# EAGLE design espnative-deadrail-2-7-rendered (EAGLE 7.6.0)
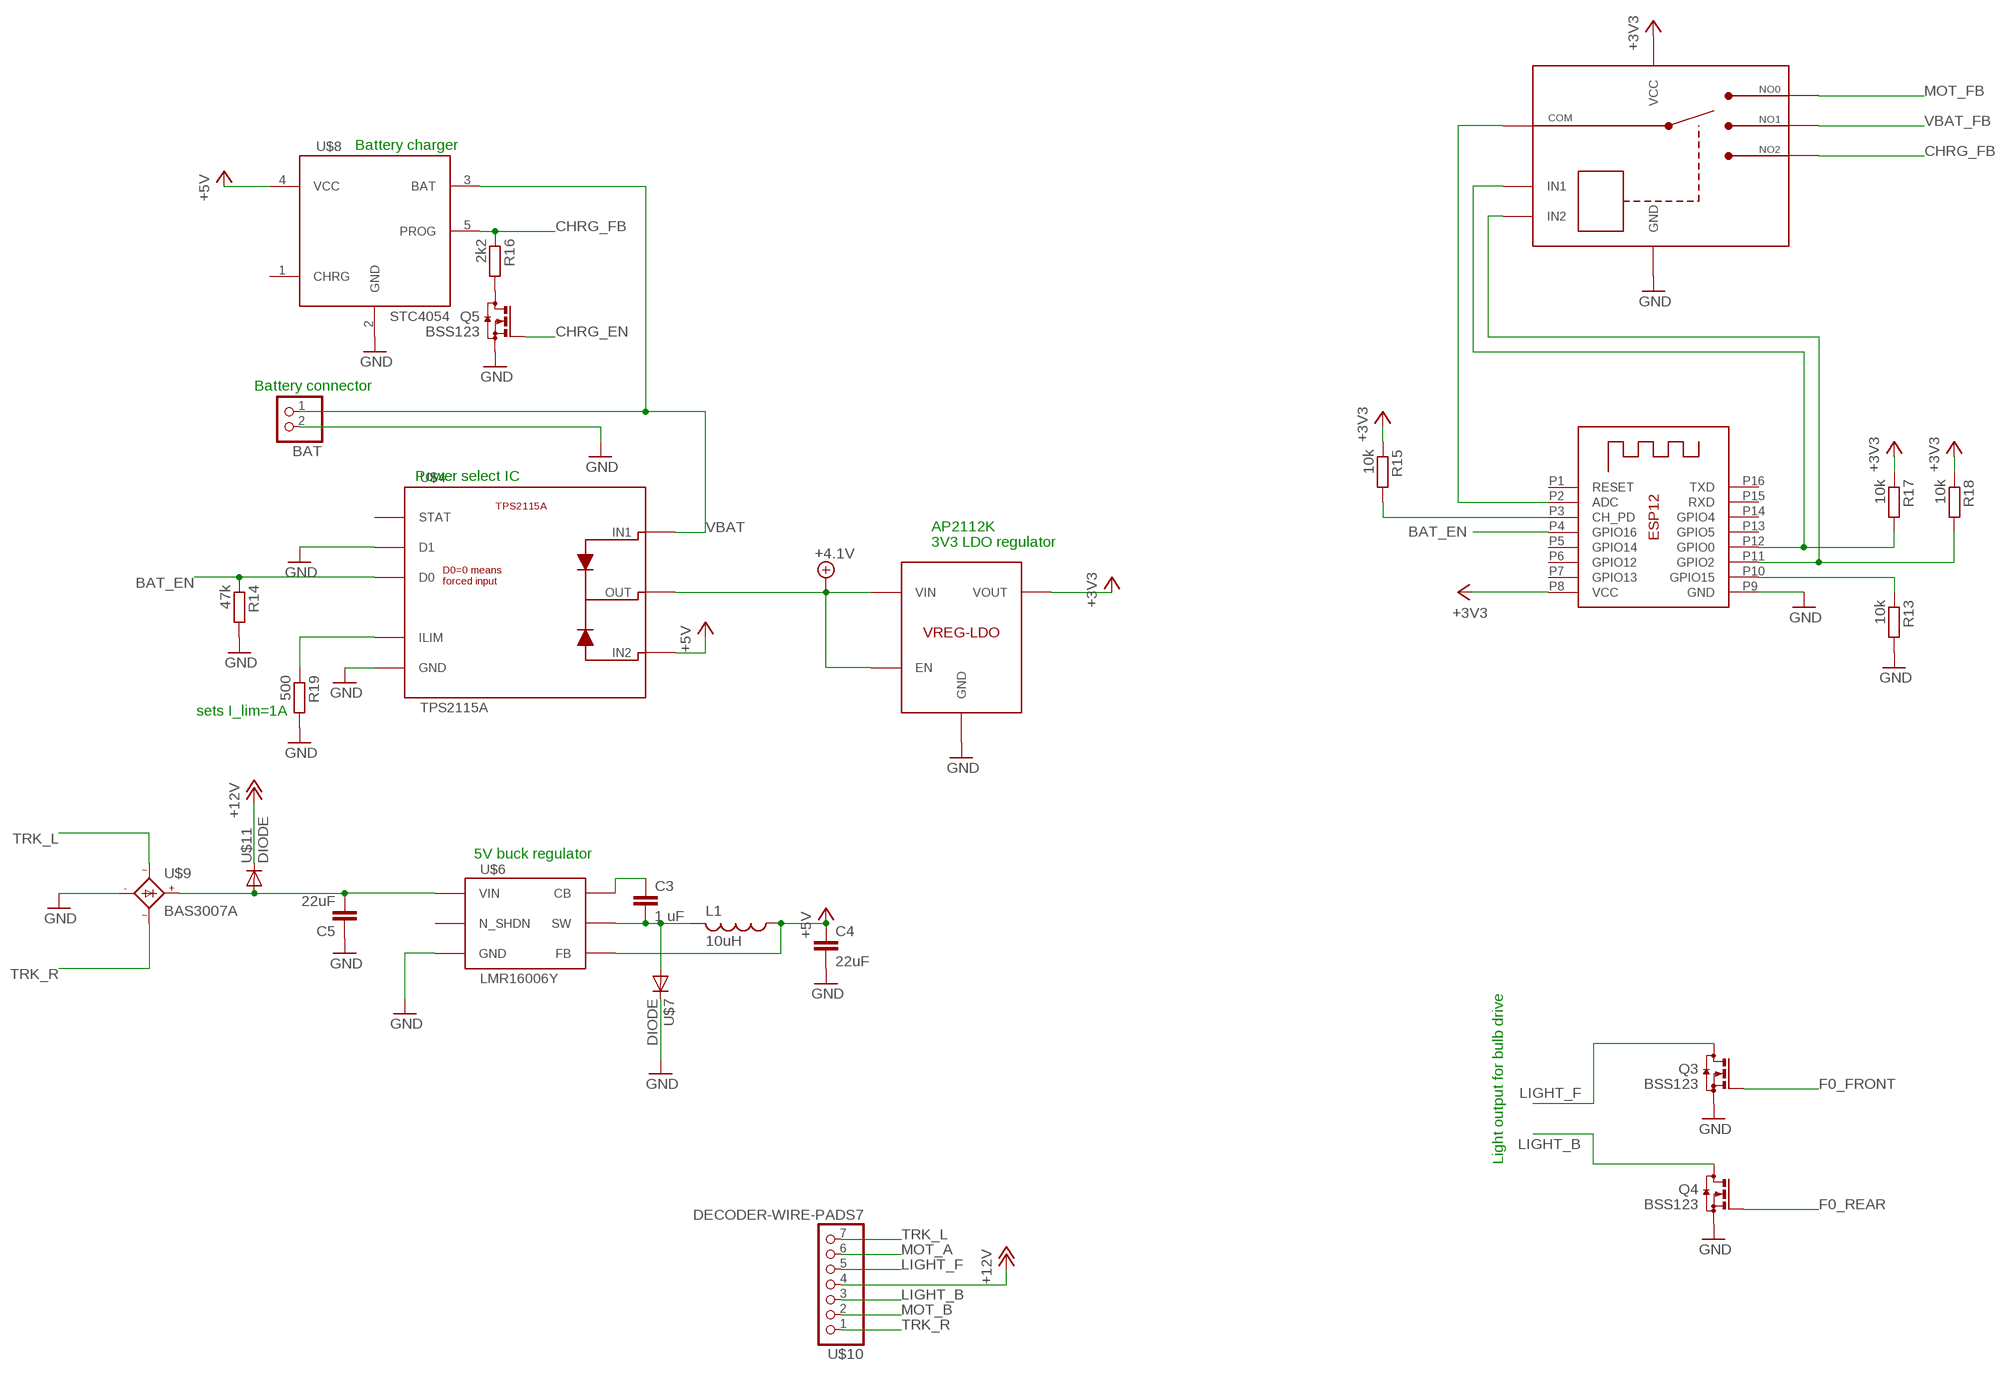
[diagram p0: schematic, sheet 1, part 1 of 2]
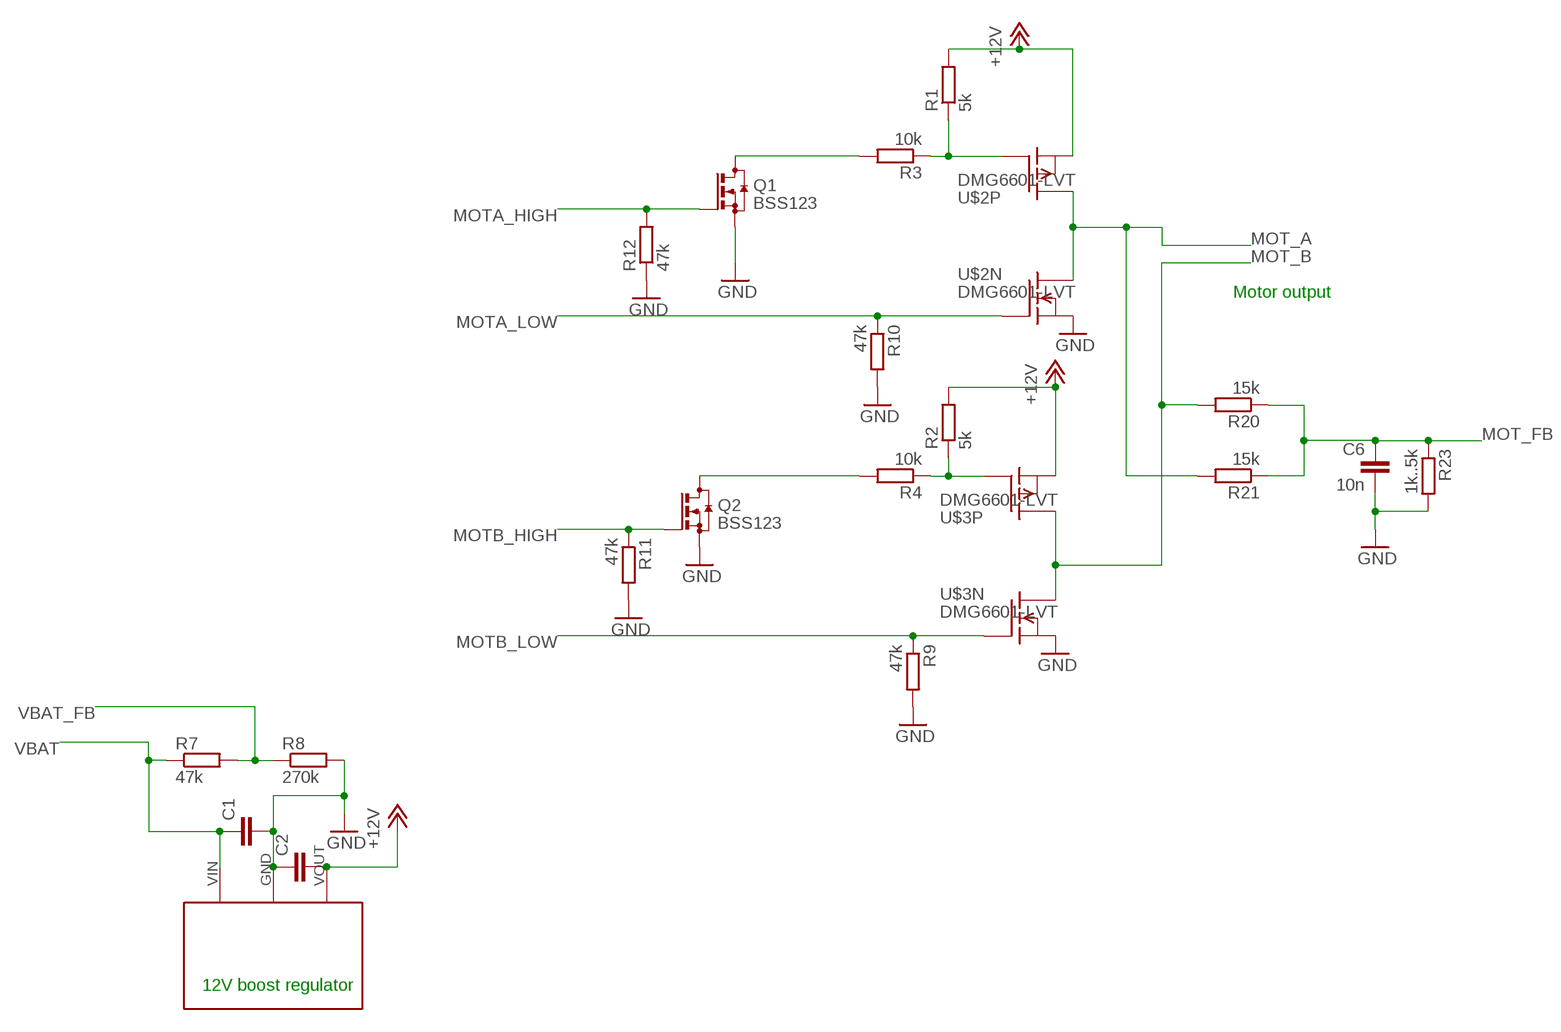
[diagram p1: schematic, sheet 1, part 2 of 2]

## Parts
BAT  JST_2PIN-SMT-RA  [JST-PH-2-SMT-RA]
C1  C-EUC1206  [C1206]
C2  C-EUC1206  [C1206]
C3  1 uF  C-EUC0603  [C0603]
C4  22uF  C-EUC0603  [C0603]
C5  22uF  C-EUC1206  [C1206]
C6  10n  C-EUC0603  [C0603]
L1  10uH  FDSD0420  [FDSD0420]
Q1  BSS123  [SOT23]
Q2  BSS123  [SOT23]
Q3  BSS123  [SOT23]
Q4  BSS123  [SOT23]
Q5  BSS123  [SOT23]
R1  5k  R-EU_R0603  [R0603]
R2  5k  R-EU_R0603  [R0603]
R3  10k  R-EU_R0603  [R0603]
R4  10k  R-EU_R0603  [R0603]
R7  47k  R-EU_R0603  [R0603]
R8  270k  R-EU_R0603  [R0603]
R9  47k  R-EU_R0603  [R0603]
R10  47k  R-EU_R0603  [R0603]
R11  47k  R-EU_R0603  [R0603]
R12  47k  R-EU_R0603  [R0603]
R13  10k  R-EU_R0603  [R0603]
R14  47k  R-EU_R0603  [R0603]
R15  10k  R-EU_R0603  [R0603]
R16  2k2  R-EU_R0603  [R0603]
R17  10k  R-EU_R0603  [R0603]
R18  10k  R-EU_R0603  [R0603]
R19  500  R-EU_R0603  [R0603]
R20  15k  R-EU_R0603  [R0603]
R21  15k  R-EU_R0603  [R0603]
R23  1k..5k  R-EU_R0603  [R0603]
U$1  AP2112K-3V3  AP2112K  [SOT23-5L]
U$2  DMG6601-LVT  [TSOT-26]
U$3  DMG6601-LVT  [TSOT-26]
U$4  TPS2115A  [TSSOP-8]
U$5  POLOLU-VREG12  [POLOLU-REGULATOR]
U$6  LMR16006Y  [SOT23-6]
U$7  DIODE  [DIODE-1206]
U$8  STC4054  [SOT23-5L]
U$9  BAS3007A  [SOT143B]
U$10  DECODER-WIRE-PADS7  [DECODER-WIRE-PADS]
U$11  DIODE  [DIODE-1206]
U$12  TS5A3359  [US8]
X1  ESP-12-TH  [ESP-12-TH]

## Nets
+3V3: R15.1 R17.1 R18.1 U$1.5(VOUT) U$12.8(VCC) X1.P8(VCC)
+4.1V: U$1.1(VIN) U$1.3(EN) U$4.7(OUT)
+5V: C4.1 L1.P$1 U$4.6(IN2) U$6.3(FB) U$8.4(VCC)
+12V: C2.2 R1.2 R2.2 U$2.2(P:S) U$3.2(P:S) U$5.VOUT U$10.4 U$11.C
BAT_EN: R14.1 U$4.2(D0) X1.P4(GPIO16)
CHRG_EN: Q5.1(G)
CHRG_FB: R16.1 U$8.5(PROG) U$12.3(NO2)
DCC_VPLUS: C5.2 U$6.5(VIN) U$9.4(+) U$11.A
F0_FRONT: Q3.1(G)
F0_REAR: Q4.1(G)
GND: BAT.2 C1.2 C2.1 C4.2 C5.1 C6.2 Q1.2(S) Q2.2(S) Q3.2(S) Q4.2(S) Q5.2(S) R8.2 R9.2 R10.2 R11.2 R12.1 R13.2 R14.2 R19.2 R23.2 U$1.2(GND) U$2.5(N:S) U$3.5(N:S) U$4.3(D1) U$4.5(GND) U$5.GND U$6.2(GND) U$7.C U$8.2(GND) U$9.1(-) U$12.4(GND) X1.P9(GND)
LIGHT_B: Q4.3(D) U$10.3
LIGHT_F: Q3.3(D) U$10.5
MOT_A: R21.2 U$2.4(P:D) U$2.6(N:D) U$10.6
MOT_B: R20.2 U$3.4(P:D) U$3.6(N:D) U$10.2
MOT_FB: C6.1 R20.1 R21.1 R23.1 U$12.1(NO0)
MOTA_HIGH: Q1.1(G) R12.2
MOTA_LOW: R10.1 U$2.1(N:G)
MOTB_HIGH: Q2.1(G) R11.1
MOTB_LOW: R9.1 U$3.1(N:G)
N$1: U$12.7(COM) X1.P2(ADC)
N$2: R1.1 R3.1 U$2.3(P:G)
N$3: Q2.3(D) R4.2
N$4: R2.1 R4.1 U$3.3(P:G)
N$5: C3.2 L1.P$2 U$6.6(SW) U$7.A
N$6: Q1.3(D) R3.2
N$8: C3.1 U$6.1(CB)
N$11: Q5.3(D) R16.2
N$12: R17.2 U$12.6(IN1) X1.P12(GPIO0)
N$17: R15.2 X1.P3(CH_PD)
N$20: R18.2 U$12.5(IN2) X1.P11(GPIO2)
N$21: R13.1 X1.P10(GPIO15)
N$22: R19.1 U$4.4(ILIM)
TRK_L: U$9.2(AC1) U$10.7
TRK_R: U$9.3(AC2) U$10.1
VBAT: BAT.1 C1.1 R7.1 U$4.8(IN1) U$5.VIN U$8.3(BAT)
VBAT_FB: R7.2 R8.1 U$12.2(NO1)
Unconnected: U$4.1(STAT) U$6.4(N_SHDN) U$8.1(CHRG) X1.P1(RESET) X1.P5(GPIO14) X1.P6(GPIO12) X1.P7(GPIO13) X1.P13(GPIO5) X1.P14(GPIO4) X1.P15(RXD) X1.P16(TXD)

## Notes on the sheet
- Battery charger
- Battery connector
- Power select IC
- AP2112K
  3V3 LDO regulator
- Motor output
- sets I_lim=1A
- 5V buck regulator
- Light output for bulb drive
- 12V boost regulator

## Library data of the parts
BAT = adafruit:JST_2PIN: JST 2-Pin Connectors of various flavors SMT-RA (S2B-PH-SM4) 4UConnector #17311 SMT (B2B-PH-SM4) THM-RA (S2B-PH) THM (B2B-PH)
C1-C6 = rcl:C-EU: CAPACITOR, European symbol
L1 = trainlib:FDSD0420
Q1-Q5 = transistor-small-signal:BSS123: N-CHANNEL MOS FET
R1-R4 R7-R21 R23 = rcl:R-EU_: RESISTOR, European symbol
U$1 = trainlib:AP2112: 600mA CMOS LDO regulator with enable http://www.diodes.com/_files/datasheets/AP2112.pdf http://www.digikey.com/product-detail/en/diodes-incorporated/AP2112K-3.3TRG1/AP2112K-3.3TRG1DICT-ND/4505257 Package includes sot23-5.
U$2 U$3 = trainlib:DMG6601-LVT: Dual N+P-channel MOSFET. Package: TSOT-26 Vmax=30V N-channel: 55mOhm, 3.8A Imax P-channel: 110mOhm, 2.5A Imax
U$4 = trainlib:TPS2115A: Power source select Ideal diode pair selects power source from two alternatives. Truth table: D0=0 selects fixed input. (D1=0 sleects IN2, D1=1 selects IN1) D0=1 selects auto-input. (D1=0 picks higher voltage, D1=1 sets shutdown) http://www.ti.com/lit/ds/symlink/tps2114a.pdf
U$5 = trainlib:POLOLU-VREG12
U$6 = trainlib:LMR16006Y: Buck regulator with 600mA output current and 2.1MHz fixed frequency. http://www.ti.com/lit/ds/symlink/lmr16006y-q1.pdf Available in sot23-6 package.
U$7 U$11 = trainlib:DIODE
U$8 = trainlib:STC4054: Single-cell Li-ion battery charger Configurable maximum current Lithium battery charger. The maximum charging current can be configured with a resistor, up to 800 mA. Charge can be enabled or inhibited. http://www.st.com/content/ccc/resource/technical/document/datasheet/df/b9/e6/5b/ec/92/45/ed/CD00132951.pdf/files/CD00132951.pdf/jcr:content/translations/en.CD00132951.pdf
U$9 = trainlib:BAS3007A: Bridge rectifier 30V typical voltage loss 0.5V, current capability up to 0.9A datasheet link <http://www.infineon.com/dgdl/bas3007aseries.pdf?folderId=db3a304313d846880113def5812204a1&fileId=db3a3043156fd5730115a286aa19083b>
U$10 = trainlib:DECODER-WIRE-PADS7
U$12 = trainlib:TS5A3359: SP3T analog mux 1-Ohm 3-way multiplexer, controlled by two input lines. http://www.ti.com/lit/ds/symlink/ts5a3359.pdf
X1 = trainlib:ESP-12-TH

## Board
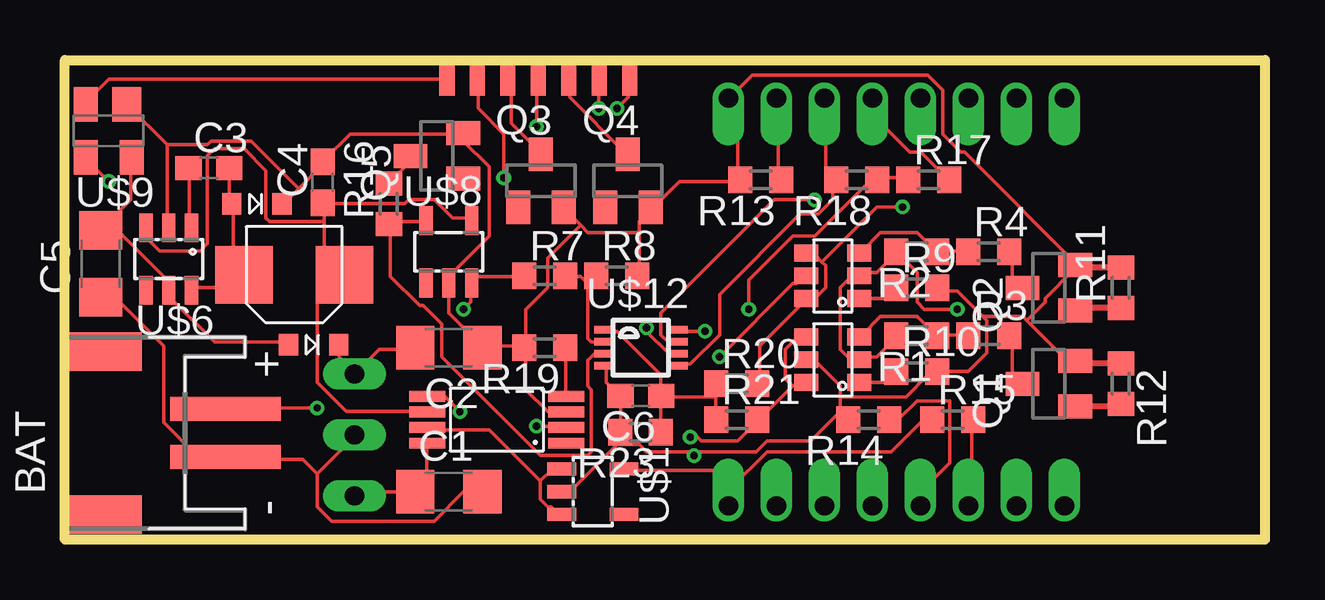
[diagram p2: board, top side]
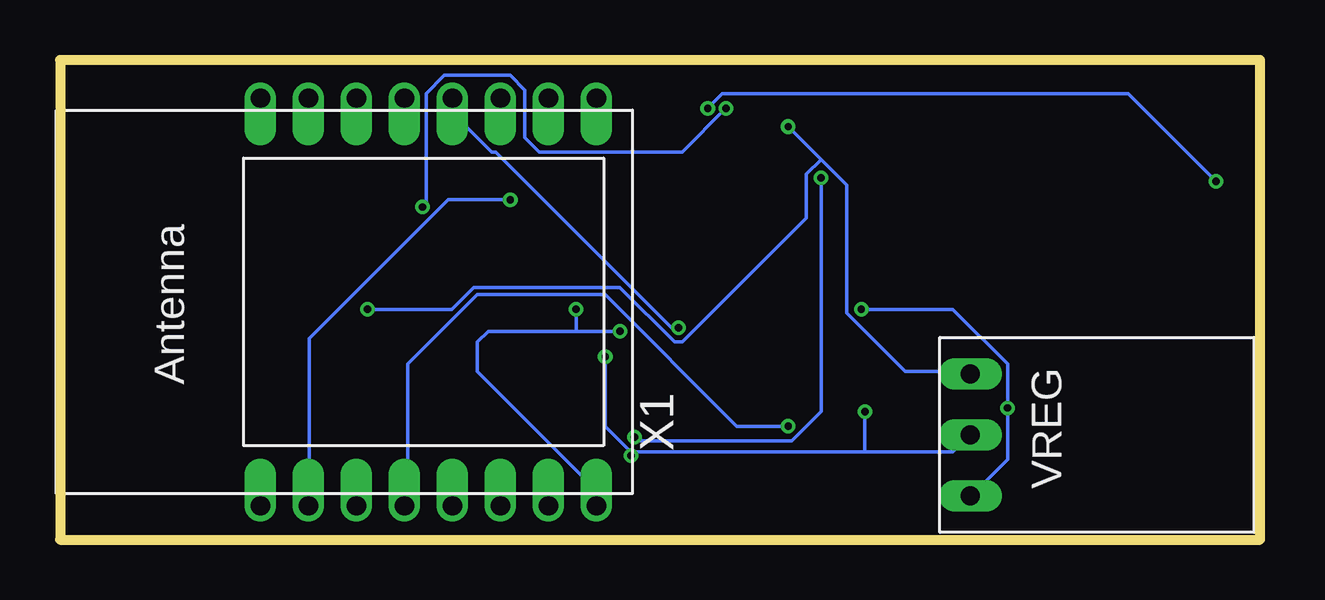
[diagram p3: board, bottom side, seen from below]

Size 50 x 20 mm. Coordinates in mm from the lower left corner, seen from the top.
Outline: 0,0 0,20 50,20 50,0 0,0
Copper layers (1*16): Top 0.035mm / dielectric 1.5mm / Bottom 0.035mm
Design rules "Fusion_eagle_rule_v1.1": minimum track width 6mil, minimum drill 12mil, track to track 6mil, track to pad 6mil, pad to pad 6mil, via to via 6mil, smd to smd 0mil, copper to edge 10mil, drill to drill 10mil, minimum pad ring 10mil, minimum via ring 6mil, stop-mask expansion 2mil, vias tented up to drill 100mil, thermal gap 10mil

### Footprints (pad centres in the part's own frame; a part is rotated, then mirrored left to right if it is on the bottom)
JST-PH-2-SMT-RA = smd 1 x 4.6: 1 1,-3.7; 2 -1,-3.7 | smd 1.6 x 3.4: NC1 -3.4,1.5; NC2 3.4,1.5
C1206 = smd 1.6 x 1.8: 1 -1.4,0; 2 1.4,0
C0603 = smd 1.1 x 1: 1 -0.85,0; 2 0.85,0
FDSD0420 = smd 2.4 x 2.4: P$1 -2.1,0; P$2 2.1,0
SOT23 = smd 1 x 1.4: 1 -0.95,-1.1; 2 0.95,-1.1; 3 0,1.1
R0603 = smd 1 x 1.1: 1 -0.85,0; 2 0.85,0
SOT23-5L = smd 0.55 x 1.2: 1 -0.95,-1.3; 2 0,-1.3; 3 0.95,-1.3; 4 0.95,1.3; 5 -0.95,1.3
TSOT-26 = smd 0.7 x 1: 1 -0.95,-1.1; 2 0,-1.1; 3 0.95,-1.1; 4 0.95,1.1; 5 0,1.1; 6 -0.95,1.1
TSSOP-8 = smd 1.5 x 0.45: 1 -2.9,0.975; 2 -2.9,0.325; 3 -2.9,-0.325; 4 -2.9,-0.975; 5 2.9,-0.975; 6 2.9,-0.325; 7 2.9,0.325; 8 2.9,0.975
POLOLU-REGULATOR = drill 0.8 long: GND 4.064,1.27; VIN 6.604,1.27; VOUT 1.524,1.27
SOT23-6 = smd 0.55 x 1.2: 1 -0.95,-1.3; 2 0,-1.3; 3 0.95,-1.3; 4 0.95,1.3; 5 0,1.3; 6 -0.95,1.3
DIODE-1206 = smd 0.8 x 0.9: A 1.05,0; C -1.05,0
SOT143B = smd 1.2 x 1.44: 1 -0.75,-1.1 | smd 1 x 1.44: 2 0.95,-1.1; 3 0.95,1.1; 4 -0.95,1.1
DECODER-WIRE-PADS = smd 1.27 x 0.635: 1 0,3.81; 2 0,2.54; 3 0,1.27; 4 0,0; 5 0,-1.27; 6 0,-2.54; 7 0,-3.81
US8 = smd 0.3 x 0.8: 1 -0.75,-1.55; 2 -0.25,-1.55; 3 0.25,-1.55; 4 0.75,-1.55; 5 0.75,1.55; 6 0.25,1.55; 7 -0.25,1.55; 8 -0.75,1.55
ESP-12-TH = drill 0.8 offset: P1 -8.5,4.5; P2 -8.5,2.5; P3 -8.5,0.5; P4 -8.5,-1.5; P5 -8.5,-3.5; P6 -8.5,-5.5; P7 -8.5,-7.5; P8 -8.5,-9.5; P9 8.5,-9.5; P10 8.5,-7.5; P11 8.5,-5.5; P12 8.5,-3.5; P13 8.5,-1.5; P14 8.5,0.5; P15 8.5,2.5; P16 8.5,4.5

### Placement (x,y rotation side)
BAT  3,4.44 90 top
C1  16,2 0 top
C2  16,8 180 top
C3  6,15.5 0 top
C4  10.75,14.9 90 top
C5  1.5,11.5 90 top
C6  24,6 180 top
L1  9.56,11.05 180 top
Q1  41,6.5 90 top
Q2  41,10.5 90 top
Q3  19.84,14.96 0 top
Q4  23.46,14.96 0 top
Q5  15.5,16 90 top
R1  35.5,8.5 180 top
R2  35.5,12 180 top
R3  38.5,8.5 0 top
R4  38.5,12 0 top
R7  20,11 0 top
R8  23,11 0 top
R9  35.5,10.5 0 top
R10  35.5,7 0 top
R11  44,10.5 90 top
R12  44,6.5 270 top
R13  29,15 180 top
R14  33.5,5 180 top
R15  37,5 0 top
R16  13.5,14 90 top
R17  36,15 0 top
R18  33,15 180 top
R19  20,8 180 top
R20  28,6.5 0 top
R21  28,5 0 top
R23  23.99,4.48 180 top
U$1  22,2 270 top
U$2  32,7.5 90 top
U$3  32,11 90 top
U$4  18,5 180 top
U$5  13.34,8.43 270 bottom
U$6  4.33,11.7 180 top
U$7  8,14 180 top
U$8  16,12 0 top
U$9  1.83,17.04 180 top
U$10  19.73,19.14 270 top
U$11  10.37,8.12 180 top
U$12  24,8 270 top
X1  37.15,9.91 90 bottom

### Tracks (layer width: path | path; a pad name or v marks a point on that pad's centre or on a via)
+3V3  (via drill 0.3)
  Top 0.152: R17.1 35.05,15.09 33.98,15.09 R18.1 33.83,14.94 33.53,14.94 31.24,12.65 30.33,12.65 28.5,10.82 v28.5,9.6 | v26.67,8.69 25.6,8.69 U$12.8 | 27.74,2.13 29.26,3.66 34.44,3.66 35.66,4.88 36.12,4.88 R15.1 | 27.74,2.13 27.74,1.52 X1.P8 27.74,2.13 | 27.74,2.13 26.98,2.9 23.32,2.9 U$1.5
  Bottom 0.152: 28.5,8.69 32.16,8.69 32.61,8.23 32.61,7.01 27.74,2.13 27.74,1.52 X1.P8 | 28.5,8.69 v26.67,8.69 | 28.5,8.69 v28.5,9.6
+4.1V
  Top 0.152: 19.81,2.44 19.81,1.68 20.12,1.37 20.27,1.37 20.57,1.07 U$1.3 | 19.81,2.44 20.27,2.9 20.57,2.9 U$1.1 | 19.81,2.44 17.68,4.57 15.24,4.57 U$4.7
+5V
  Top 0.152: 10.82,13.26 10.82,11.89 11.58,11.12 L1.P$1 11.58,10.97 10.52,9.91 10.52,6.55 11.73,5.33 15.09,5.33 U$4.6 | 10.82,13.26 10.82,14.02 | 10.82,13.26 8.53,13.26 8.38,13.41 8.38,15.39 7.47,16.31 6.25,16.31 5.94,16 5.94,12.34 5.64,12.04 3.96,12.04 3.5,12.5 3.5,12.95 U$6.3 | 10.82,14.02 14.17,14.02 14.33,14.17 15.39,14.17 16.15,13.41 16.92,13.41 U$8.4 | 10.82,14.02 C4.1
+12V  (via drill 0.3)
  Top 0.152: R1.2 34.59,8.38 33.83,7.62 33.22,7.62 U$2.2 33.07,7.62 32.61,7.62 32.31,7.92 32.31,10.52 32.77,10.97 33.07,10.97 U$3.2 33.22,11.12 33.83,11.12 34.59,11.89 R2.2 34.75,11.89 35.51,11.12 35.51,9.91 35.81,9.6 v37.19,9.6 | U$11.C 11.43,8.08 11.43,7.62 12.04,7.01 U$5.VOUT 12.19,7.01 13.11,7.92 14.48,7.92 C2.2 | v19.66,17.22 19.66,19.05 U$10.4
  Bottom 0.152: 18.29,15.85 17.22,14.78 17.22,9.45 14.78,7.01 12.19,7.01 U$5.VOUT | 18.29,15.85 v19.66,17.22 | v37.19,9.6 33.68,9.6 32.77,10.52 26.67,10.52 24.38,8.23 24.08,8.23 18.9,13.41 18.9,15.24 18.29,15.85
BAT_EN  (via drill 0.3)
  Top 0.152: R14.1 34.44,5.03 34.75,5.03 35.51,5.79 36.88,5.79 36.88,3.2 35.66,1.98 35.66,1.52 X1.P4 | v19.66,4.72 20.88,4.72 U$4.2
  Bottom 0.152: v19.66,4.72 21.79,4.72 27.28,10.21 32.61,10.21 35.51,7.32 35.51,1.52 X1.P4
CHRG_FB
  Top 0.152: U$12.3 22.4,7.77 22.1,7.77 21.79,7.47 21.79,6.4 21.95,6.25 21.95,3.66 21.79,3.5 19.81,3.5 15.7,7.62 15.7,8.99 14.94,9.75 14.78,9.75 13.56,10.97 13.56,13.11 R16.1 13.56,13.26 14.94,13.26 U$8.5
DCC_VPLUS
  Top 0.152: 1.83,13.26 1.52,12.95 C5.2 1.83,13.26 | 1.83,13.26 2.74,14.17 2.74,15.85 U$9.4 | U$11.A 9.3,8.23 6.25,8.23 4.42,10.06 4.42,10.36 U$6.5 4.27,10.52 4.27,10.82 1.83,13.26
GND  (via drill 0.3)
  Top 0.152: C5.1 1.52,10.06 2.13,10.06 4.12,8.08 4.12,4.88 5.49,3.5 6.55,3.5 BAT.2 6.71,3.35 9.91,3.35 10.52,2.74 | v27.28,7.62 30.33,10.67 30.48,10.67 30.79,10.97 U$3.5 | v16.46,5.33 15.85,5.94 15.24,5.94 U$4.5 | 10.52,2.74 10.52,1.37 11.12,0.76 15.39,0.76 16.61,1.98 17.37,1.98 C1.2 | 10.52,2.74 12.04,4.27 U$5.GND | U$12.4 22.55,7.16 22.55,6.55 23.01,6.1 C6.2 23.16,5.94 23.16,4.57 R23.2 | 23.01,3.96 21.18,2.13 20.73,2.13 U$1.2 | 23.01,3.96 23.01,4.42 R23.2 | 32.31,5.33 32.31,5.94 | 32.31,5.94 32.31,6.4 31.24,7.47 30.94,7.47 U$2.5 | 32.31,5.33 32.61,5.03 R14.2 32.31,5.33 | 32.31,5.94 35.05,5.94 35.97,6.86 36.27,6.86 R10.2 36.42,7.01 37.64,7.01 38.41,7.77 38.41,9.14 38.25,9.3 | 38.25,9.3 37.19,10.36 36.42,10.36 R9.2 | 40.08,9.14 39.93,9.3 38.25,9.3 | 40.08,9.14 41.76,7.47 42.06,7.47 Q1.2 | 40.08,9.14 40.84,9.91 40.84,10.06 42.06,11.28 Q2.2 42.06,11.58 37.49,16.15 37.34,16.15 36.58,16.92 36.58,18.75 35.97,19.36 28.65,19.36 27.74,18.44 X1.P9 27.74,18.29 28.04,17.98 28.04,15.09 R13.2 28.04,14.94 25.6,14.94 24.54,13.87 Q4.2 24.38,13.72 23.93,13.26 23.93,12.8 | 23.01,3.96 23.93,3.96 24.23,3.66 26.21,3.66 | 26.21,3.66 28.8,3.66 29.26,4.12 31.09,4.12 32.31,5.33 | 23.01,3.96 R23.2 | 4.27,16.46 4.27,13.11 U$6.2 | 4.27,16.46 2.59,18.14 U$9.1 | 9.75,14.63 10.82,15.7 C4.2 10.82,15.85 11.89,16.92 16.46,16.92 Q5.2 16.61,16.92 16.61,16.61 17.68,15.54 17.68,12.65 15.85,10.82 U$8.2 16,10.67 16,9.45 17.37,8.08 C2.1 17.53,8.08 19.05,8.08 R19.2 | 9.75,14.63 9.14,14.02 U$7.C | 4.27,16.46 5.94,16.46 6.1,16.61 7.77,16.61 9.75,14.63 | U$4.3 20.88,5.33 20.12,5.33 19.2,6.25 19.2,7.92 R19.2
  Top 0.152: 23.93,12.8 23.93,11.12 R8.2 | 21.49,13.11 21.79,12.8 23.93,12.8 | 21.49,13.11 20.88,13.72 Q3.2 | 21.49,13.11 20.12,11.73 20.12,10.52 19.2,9.6 19.2,8.08 R19.2 | 26.21,3.66 v26.21,3.5
  Top 0.254: R11.2 42.1,11.35 Q2.2 | R12.1 42.1,7.35 Q1.2
  Bottom 0.152: v27.28,7.62 27.28,4.72 26.21,3.66 | 16.46,3.66 12.8,3.66 12.19,4.27 U$5.GND | 16.46,3.66 26.21,3.66 | 16.46,3.66 v16.46,5.33 | v26.21,3.5 26.21,3.66
LIGHT_B
  Top 0.152: U$10.3 21.03,19.05 21.03,18.44 23.32,16.15 Q4.3
LIGHT_F
  Top 0.152: U$10.5 18.59,19.05 18.59,17.37 19.81,16.15 Q3.3
MOT_A  (via drill 0.3)
  Top 0.152: 30.33,6.4 30.79,6.4 U$2.6 | 30.33,6.4 28.96,5.03 R21.2 28.8,4.88 28.04,4.12 26.52,4.12 26.36,4.27 v26.06,4.27 | 30.33,6.4 30.02,6.71 30.02,7.92 30.48,8.38 30.79,8.38 U$2.4 | v18.29,15.09 18.29,16.92 17.22,17.98 17.22,19.05 U$10.6
  Bottom 0.152: v18.29,15.09 18.29,5.33 19.51,4.12 25.91,4.12 v26.06,4.27
MOT_B  (via drill 0.3)
  Top 0.152: 31.55,11.58 31.24,11.89 30.94,11.89 U$3.4 | 31.55,11.58 31.7,11.43 31.7,10.52 31.24,10.06 30.94,10.06 U$3.6 30.79,9.91 28.96,8.08 28.96,6.55 R20.2 | v22.25,17.98 22.25,19.05 U$10.2 | v34.9,13.87 33.83,13.87 31.55,11.58
  Bottom 0.152: v22.25,17.98 24.08,16.15 30.02,16.15 30.63,16.76 30.63,18.75 31.24,19.36 33.98,19.36 34.75,18.59 34.75,14.02 v34.9,13.87
MOT_FB
  Top 0.152: 27.13,5.94 27.13,6.4 R20.1 | 27.13,5.94 27.13,5.03 R21.1 | U$12.1 22.55,8.69 23.01,8.69 24.84,6.86 24.84,6.1 C6.1 | R23.1 24.84,4.57 24.84,5.94 C6.1 | 27.13,5.94 24.99,5.94 C6.1
MOTA_HIGH
  Top 0.254: R12.2 44,6 43.55,5.55 Q1.1
MOTA_LOW
  Top 0.152: U$2.1 33.22,6.55 34.29,6.55 34.59,6.86 R10.1
MOTB_HIGH
  Top 0.254: R11.1 42.1,9.65 Q2.1
MOTB_LOW
  Top 0.152: U$3.1 33.22,10.06 34.29,10.06 34.59,10.36 R9.1
N$1  (via drill 0.3)
  Top 0.152: v31.24,14.17 29.57,14.17 24.84,9.45 24.84,8.53 25.15,8.23 25.45,8.23 U$12.7
  Bottom 0.152: v31.24,14.17 33.83,14.17 39.62,8.38 39.62,1.52 X1.P2
N$2
  Top 0.152: U$2.3 33.22,8.53 33.98,9.3 35.51,9.3 36.27,8.53 R1.1 36.42,8.53 37.64,8.53 R3.1
N$3
  Top 0.152: R4.2 39.47,11.89 39.47,10.82 39.78,10.52 Q2.3
N$4
  Top 0.152: U$3.3 33.22,12.04 33.98,12.8 35.51,12.8 36.27,12.04 R2.1 36.42,12.04 37.64,12.04 R4.1
N$5
  Top 0.152: C3.2 6.86,15.39 6.86,14.02 U$7.A 7.01,13.87 7.01,11.43 7.32,11.12 L1.P$2 7.32,10.97 6.86,10.52 5.33,10.52 U$6.6
N$6
  Top 0.152: R3.2 39.47,8.38 39.47,6.86 39.78,6.55 Q1.3
N$8
  Top 0.152: C3.1 5.18,15.39 5.18,13.11 U$6.1
N$11
  Top 0.152: R16.2 13.56,14.94 14.48,15.85 Q5.3
N$12  (via drill 0.3)
  Top 0.152: v24.23,8.84 24.23,8.69 25.15,7.77 25.45,7.77 U$12.6 | R17.2 36.73,15.09 35.66,16.15 35.2,16.15 33.68,17.68 33.68,18.29 X1.P12
  Bottom 0.152: v24.23,8.84 24.54,8.84 31.85,16.15 32,16.15 33.53,17.68 33.53,18.29 X1.P12
N$17
  Top 0.152: R15.2 37.8,4.88 37.8,1.52 X1.P3
N$20
  Top 0.152: U$12.5 25.6,7.32 26.06,7.32 27.28,8.53 27.28,10.21 30.63,13.56 31.39,13.56 32,14.17 32,14.94 R18.2 32,15.09 31.7,15.39 31.7,18.29 X1.P11
N$21
  Top 0.152: R13.1 29.72,15.09 29.72,18.29 X1.P10
N$22
  Top 0.152: R19.1 20.88,7.92 20.88,6.1 U$4.4
TRK_L
  Top 0.152: U$10.7 15.85,19.2 1.83,19.2 0.91,18.29 U$9.2
TRK_R  (via drill 0.3)
  Top 0.152: v23.01,17.98 23.47,18.44 23.47,19.05 U$10.1 | v1.83,14.94 0.91,15.85 U$9.3
  Bottom 0.152: v23.01,17.98 22.4,18.59 5.49,18.59 v1.83,14.94
VBAT  (via drill 0.3)
  Top 0.152: U$4.8 15.09,3.96 15.09,2.59 14.63,2.13 C1.1 14.48,1.98 12.34,1.98 12.19,1.83 U$5.VIN | R7.1 19.05,10.97 17.22,10.97 17.07,10.82 U$8.3 16.92,10.67 16.92,9.91 v16.61,9.6 | v10.52,5.49 6.71,5.49 BAT.1
  Bottom 0.152: v16.61,9.6 12.8,9.6 10.52,7.32 v10.52,5.49 10.52,3.35 12.04,1.83 U$5.VIN
VBAT_FB
  Top 0.152: 21.79,10.67 21.79,8.38 21.95,8.23 22.4,8.23 U$12.2 | 21.79,10.67 22.1,10.97 R8.1 21.79,10.67 | 21.79,10.67 21.49,10.97 20.88,10.97 R7.2